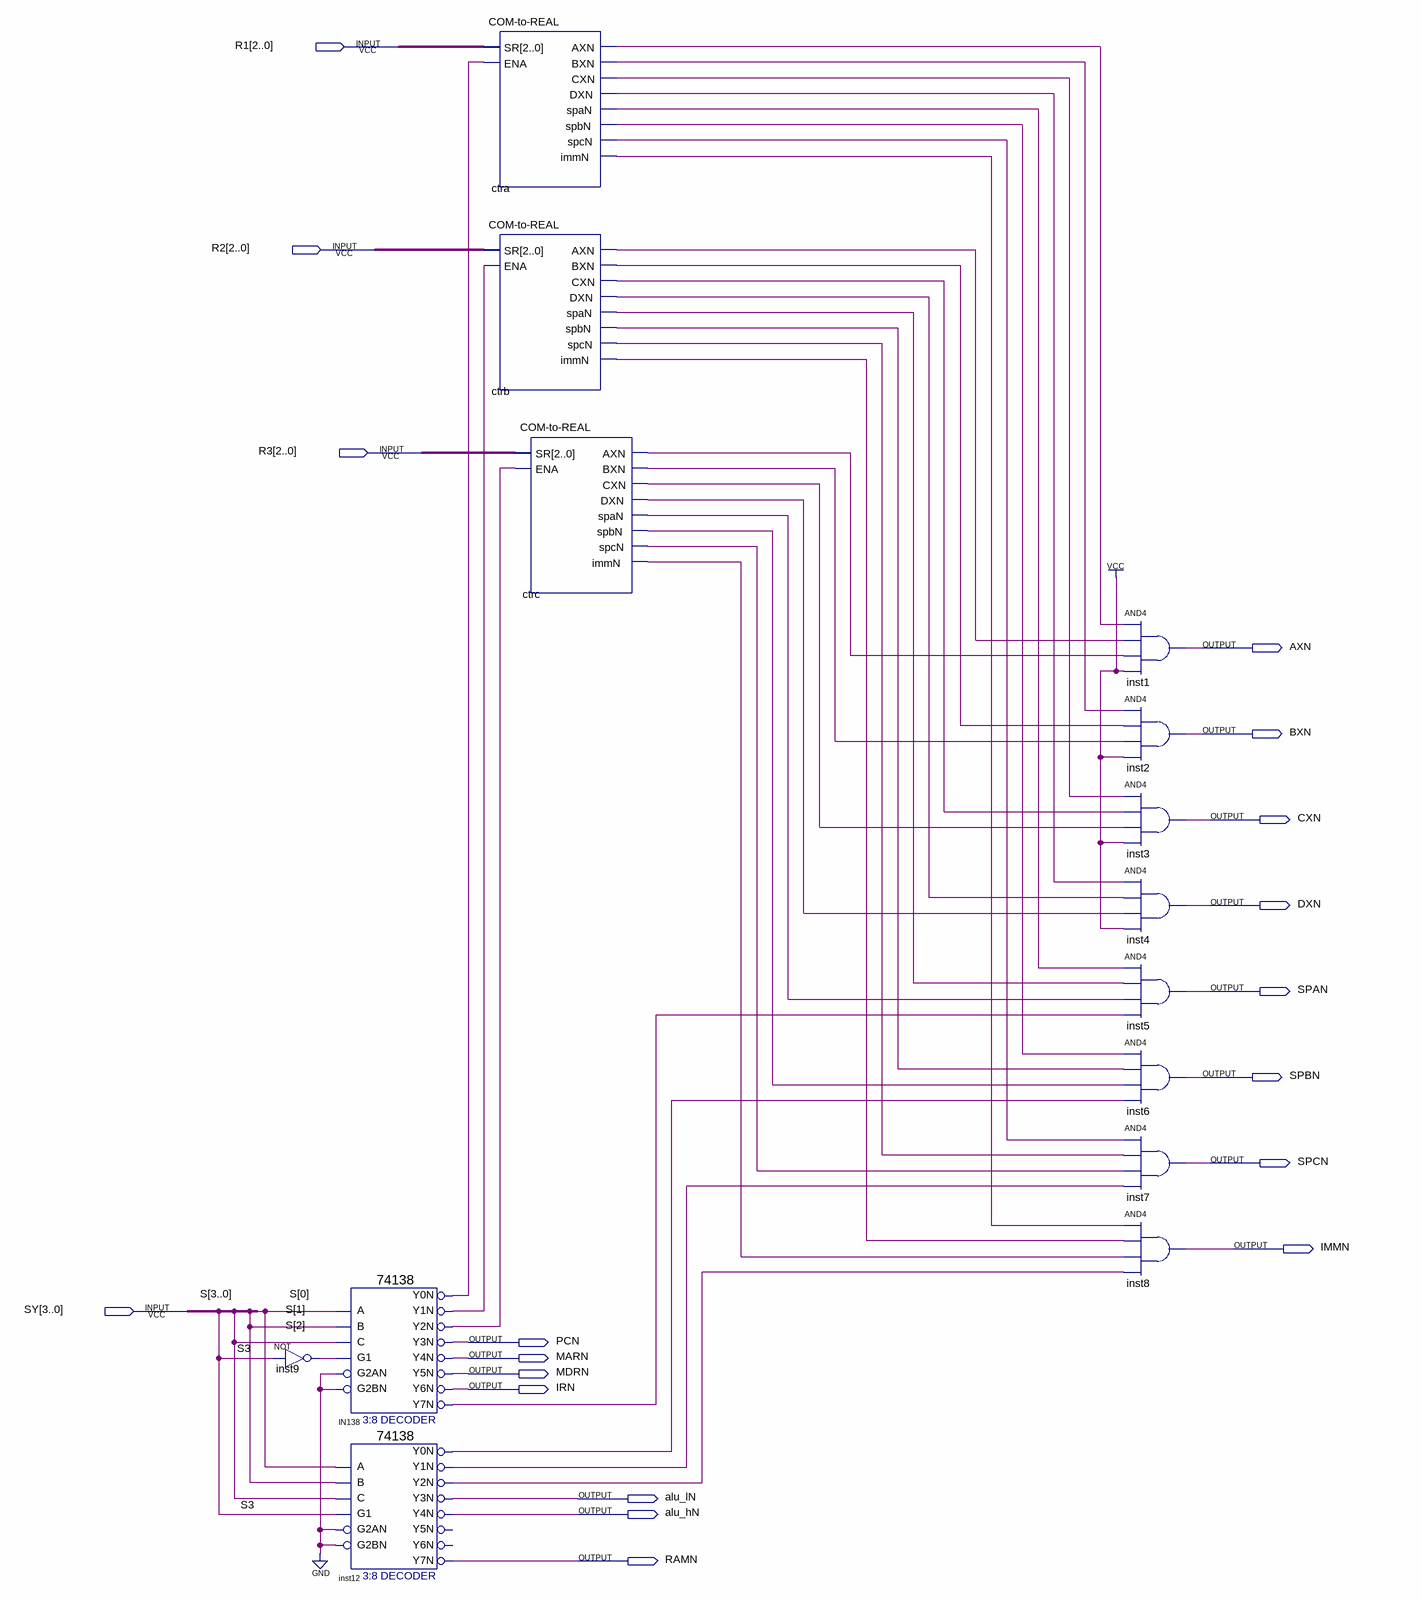
[diagram p0: schematic sheet]
// Quartus schematic FINDER.bdf as structural Verilog: 14 symbols, 19 pins
module FINDER (
  input  [2:0] R1,
  input  [2:0] R2,
  input  [2:0] R3,
  input  [3:0] SY,
  output AXN,
  output BXN,
  output CXN,
  output DXN,
  output SPAN,
  output SPBN,
  output SPCN,
  output IMMN,
  output PCN,
  output MARN,
  output MDRN,
  output IRN,
  output alu_lN,
  output alu_hN,
  output RAMN
);

  wire ctra_axn, ctra_bxn, ctra_cxn, ctra_dxn, ctra_immn, ctra_span, ctra_spbn, ctra_spcn, ctrb_axn,
       ctrb_bxn, ctrb_cxn, ctrb_dxn, ctrb_immn, ctrb_span, ctrb_spbn, ctrb_spcn, ctrc_axn, ctrc_bxn,
       ctrc_cxn, ctrc_dxn, ctrc_immn, ctrc_span, ctrc_spbn, ctrc_spcn, IN138_y0n, IN138_y1n, IN138_y2n,
       IN138_y7n, inst9_out, inst12_y0n, inst12_y1n, inst12_y2n;

  not inst9 (inst9_out, SY[3]);
  \74138  IN138 (
    .A(SY[0]), .B(SY[1]), .G1(inst9_out), .C(SY[2]), .G2AN(1'b0), .G2BN(1'b0), .Y0N(IN138_y0n),
    .Y1N(IN138_y1n), .Y2N(IN138_y2n), .Y3N(PCN), .Y4N(MARN), .Y5N(MDRN), .Y6N(IRN), .Y7N(IN138_y7n));
  \74138  inst12 (
    .A(SY[0]), .B(SY[1]), .G1(SY[3]), .C(SY[2]), .G2AN(1'b0), .G2BN(1'b0), .Y0N(inst12_y0n),
    .Y1N(inst12_y1n), .Y2N(inst12_y2n), .Y3N(alu_lN), .Y4N(alu_hN), .Y7N(RAMN));  // open: Y5N, Y6N
  \COM-to-REAL  ctra (
    .SR(R1), .ENA(IN138_y0n), .AXN(ctra_axn), .BXN(ctra_bxn), .CXN(ctra_cxn), .DXN(ctra_dxn),
    .spaN(ctra_span), .spbN(ctra_spbn), .spcN(ctra_spcn), .immN(ctra_immn));
  \COM-to-REAL  ctrb (
    .SR(R2), .ENA(IN138_y1n), .AXN(ctrb_axn), .BXN(ctrb_bxn), .CXN(ctrb_cxn), .DXN(ctrb_dxn),
    .spaN(ctrb_span), .spbN(ctrb_spbn), .spcN(ctrb_spcn), .immN(ctrb_immn));
  \COM-to-REAL  ctrc (
    .SR(R3), .ENA(IN138_y2n), .AXN(ctrc_axn), .BXN(ctrc_bxn), .CXN(ctrc_cxn), .DXN(ctrc_dxn),
    .spaN(ctrc_span), .spbN(ctrc_spbn), .spcN(ctrc_spcn), .immN(ctrc_immn));
  and inst1 (AXN, ctra_axn, ctrb_axn, ctrc_axn, 1'b1);
  and inst2 (BXN, ctra_bxn, ctrb_bxn, ctrc_bxn, 1'b1);
  and inst3 (CXN, ctra_cxn, ctrb_cxn, ctrc_cxn, 1'b1);
  and inst4 (DXN, ctra_dxn, ctrb_dxn, ctrc_dxn, 1'b1);
  and inst5 (SPAN, ctra_span, ctrb_span, ctrc_span, IN138_y7n);
  and inst6 (SPBN, ctra_spbn, ctrb_spbn, ctrc_spbn, inst12_y0n);
  and inst7 (SPCN, ctra_spcn, ctrb_spcn, ctrc_spcn, inst12_y1n);
  and inst8 (IMMN, ctra_immn, ctrb_immn, ctrc_immn, inst12_y2n);

  // Other names for the same wires on the sheet: S[3:0] = SY; S3 = SY[3]
endmodule
